# Altium schematic sheet MQ.SchDoc
size A4; SheetNumber: 2; SheetTotal: 6
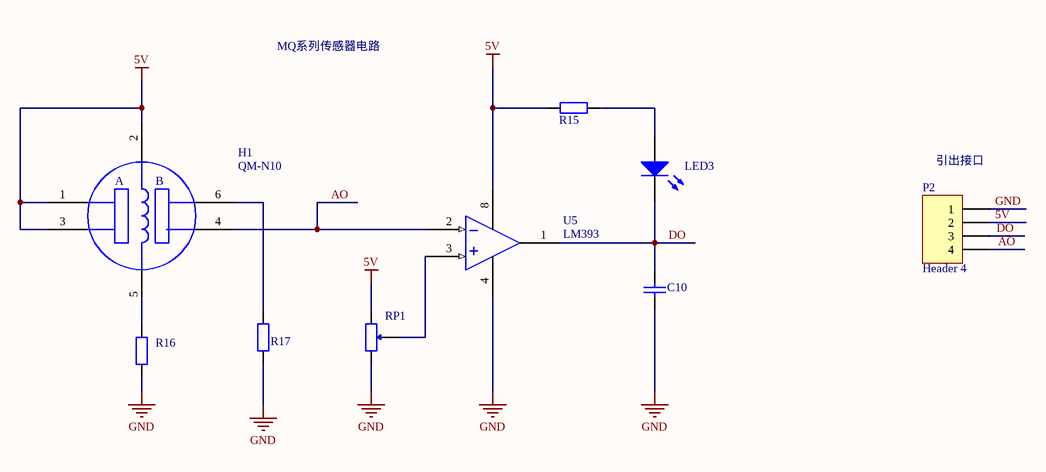
[diagram p0: MQ.SchDoc]

## Parts
C10  104  [C0805_L]  (value not drawn)
H1  QM-N10
LED3  红色  [LED0805_G]  (value not drawn)
P2  Header 4  [HDR1X4]
R15  1K  [R0805_L]  (value not drawn)
R16  1K  [R0805_L]  (value not drawn)
R17  1K  [R0805_L]  (value not drawn)
RP1  10K  [3303W]  (value not drawn)
U5  LM393

## Nets
5V: P2.2 R15.2 RP1.1
GND: C10.1 P2.1 R16.1 R17.1 RP1.3
AO: P2.4 U5.2
DO: C10.2 LED3.2(K) P2.3
NetLED3_1: LED3.1(A) R15.1
NetRP1_2: RP1.2 U5.3

Not connected (* = marked no-connect by the designer): H1 1 2 3 4(_) 5(_) 6(_); R16 2; R17 2; U5 1(_) 4(_) 8(_)

## Notes on the sheet
- MQ系列传感器电路
- (near P2) 引出接口
- (in symbol QM-N10) A; B

## Library data of the parts
C10 = C: 贴片电容/MLCC电容; BOM名称: 无极性贴片电容; 联系下单店铺卖家 免费帮你查找封装: 联系下单店铺卖家 免费技术支持
LED3 = LED: 贴片LED; 封装库来自淘宝卖家：黄晶宝石: 其他店铺购入均为盗版封装库，无更新权益，退款现金奖励200~1000元; BOM名称: 贴片LED
P2 = Header 4: Header, 4-Pin; LatestRevisionDate: 17-Jul-2002; LatestRevisionNote: Re-released for DXP Platform.; Publisher: Altium Limited
R15-R17 = R: 贴片电阻; 当前库版本V2022.10.7 @黄晶宝石: 最新版本发布https://shop463601444.taobao.com; BOM名称: 贴片电阻
RP1 = RP-SMD: 贴片电位器; 联系下单店铺卖家 免费帮你查找封装: 联系下单店铺卖家 免费技术支持; BOM名称: 贴片电位器